# Altium schematic sheet WS2812.SchDoc
size A4
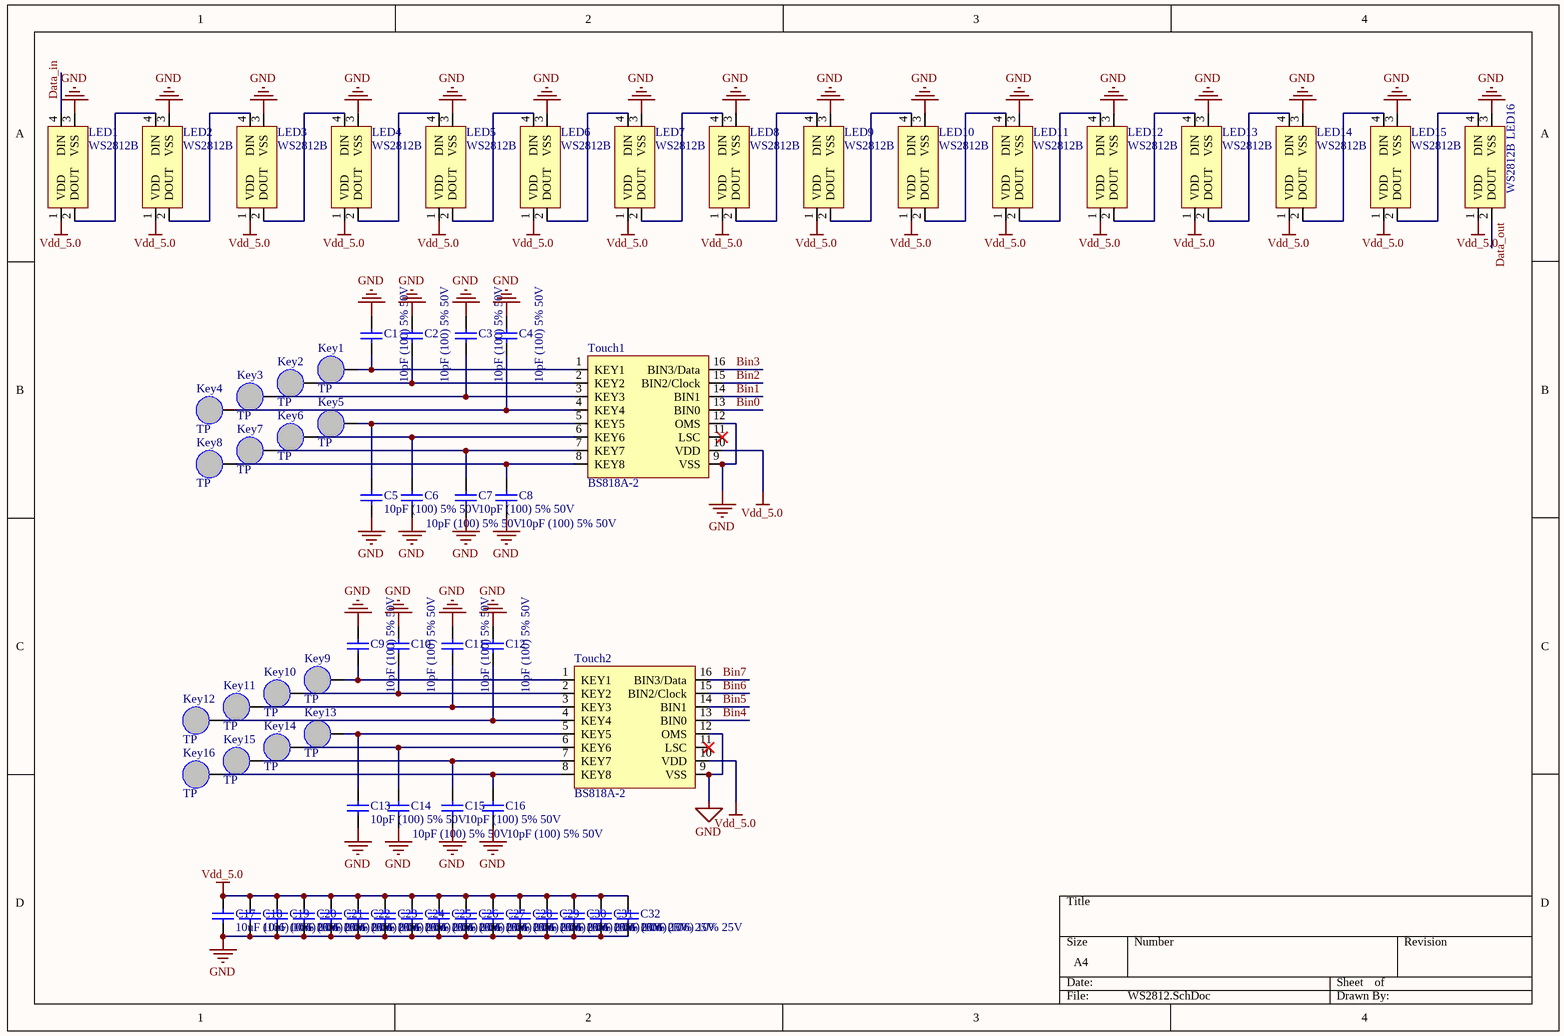
[diagram p0: WS2812.SchDoc]

## Parts
C1  10pF (100) 5% 50V  [0603_C]
C2  10pF (100) 5% 50V  [0603_C]
C3  10pF (100) 5% 50V  [0603_C]
C4  10pF (100) 5% 50V  [0603_C]
C5  10pF (100) 5% 50V  [0603_C]
C6  10pF (100) 5% 50V  [0603_C]
C7  10pF (100) 5% 50V  [0603_C]
C8  10pF (100) 5% 50V  [0603_C]
C9  10pF (100) 5% 50V  [0603_C]
C10  10pF (100) 5% 50V  [0603_C]
C11  10pF (100) 5% 50V  [0603_C]
C12  10pF (100) 5% 50V  [0603_C]
C13  10pF (100) 5% 50V  [0603_C]
C14  10pF (100) 5% 50V  [0603_C]
C15  10pF (100) 5% 50V  [0603_C]
C16  10pF (100) 5% 50V  [0603_C]
C17  10uF (106) 10% 25V  [0805_C]
C18  10uF (106) 10% 25V  [0805_C]
C19  10uF (106) 10% 25V  [0805_C]
C20  10uF (106) 10% 25V  [0805_C]
C21  10uF (106) 10% 25V  [0805_C]
C22  10uF (106) 10% 25V  [0805_C]
C23  10uF (106) 10% 25V  [0805_C]
C24  10uF (106) 10% 25V  [0805_C]
C25  10uF (106) 10% 25V  [0805_C]
C26  10uF (106) 10% 25V  [0805_C]
C27  10uF (106) 10% 25V  [0805_C]
C28  10uF (106) 10% 25V  [0805_C]
C29  10uF (106) 10% 25V  [0805_C]
C30  10uF (106) 10% 25V  [0805_C]
C31  10uF (106) 10% 25V  [0805_C]
C32  10uF (106) 10% 25V  [0805_C]
Key1  TP  [Spring_touch]
Key2  TP  [Spring_touch]
Key3  TP  [Spring_touch]
Key4  TP  [Spring_touch]
Key5  TP  [Spring_touch]
Key6  TP  [Spring_touch]
Key7  TP  [Spring_touch]
Key8  TP  [Spring_touch]
Key9  TP  [Spring_touch]
Key10  TP  [Spring_touch]
Key11  TP  [Spring_touch]
Key12  TP  [Spring_touch]
Key13  TP  [Spring_touch]
Key14  TP  [Spring_touch]
Key15  TP  [Spring_touch]
Key16  TP  [Spring_touch]
LED1  WS2812B  [WS2812]
LED2  WS2812B  [WS2812]
LED3  WS2812B  [WS2812]
LED4  WS2812B  [WS2812]
LED5  WS2812B  [WS2812]
LED6  WS2812B  [WS2812]
LED7  WS2812B  [WS2812]
LED8  WS2812B  [WS2812]
LED9  WS2812B  [WS2812]
LED10  WS2812B  [WS2812]
LED11  WS2812B  [WS2812]
LED12  WS2812B  [WS2812]
LED13  WS2812B  [WS2812]
LED14  WS2812B  [WS2812]
LED15  WS2812B  [WS2812]
LED16  WS2812B  [WS2812]
Touch1  BS818A-2  [SO-16_N]
Touch2  BS818A-2  [SO-16_N]

## Nets
GND: C1.2 C2.2 C3.2 C4.2 C5.2 C6.2 C7.2 C8.2 C9.2 C10.2 C11.2 C12.2 C13.2 C14.2 C15.2 C16.2 C17.1 C18.1 C19.1 C20.1 C21.1 C22.1 C23.1 C24.1 C25.1 C26.1 C27.1 C28.1 C29.1 C30.1 C31.1 C32.1 LED1.3(VSS) LED2.3(VSS) LED3.3(VSS) LED4.3(VSS) LED5.3(VSS) LED6.3(VSS) LED7.3(VSS) LED8.3(VSS) LED9.3(VSS) LED10.3(VSS) LED11.3(VSS) LED12.3(VSS) LED13.3(VSS) LED14.3(VSS) LED15.3(VSS) LED16.3(VSS) Touch1.9(VSS) Touch1.12(OMS) Touch2.9(VSS) Touch2.12(OMS)
Vdd_5.0: C17.2 C18.2 C19.2 C20.2 C21.2 C22.2 C23.2 C24.2 C25.2 C26.2 C27.2 C28.2 C29.2 C30.2 C31.2 C32.2 LED1.1(VDD) LED2.1(VDD) LED3.1(VDD) LED4.1(VDD) LED5.1(VDD) LED6.1(VDD) LED7.1(VDD) LED8.1(VDD) LED9.1(VDD) LED10.1(VDD) LED11.1(VDD) LED12.1(VDD) LED13.1(VDD) LED14.1(VDD) LED15.1(VDD) LED16.1(VDD) Touch1.10(VDD) Touch2.10(VDD)
Bin0: Touch1.13(BIN0)
Bin1: Touch1.14(BIN1)
Bin2: Touch1.15(BIN2/Clock)
Bin3: Touch1.16(BIN3/Data)
Bin4: Touch2.13(BIN0)
Bin5: Touch2.14(BIN1)
Bin6: Touch2.15(BIN2/Clock)
Bin7: Touch2.16(BIN3/Data)
Data_in: LED1.4(DIN)
Data_out: LED16.2(DOUT)
NetC1_1: C1.1 Key1.1 Touch1.1(KEY1)
NetC2_1: C2.1 Key2.1 Touch1.2(KEY2)
NetC3_1: C3.1 Key3.1 Touch1.3(KEY3)
NetC4_1: C4.1 Key4.1 Touch1.4(KEY4)
NetC5_1: C5.1 Key5.1 Touch1.5(KEY5)
NetC6_1: C6.1 Key6.1 Touch1.6(KEY6)
NetC7_1: C7.1 Key7.1 Touch1.7(KEY7)
NetC8_1: C8.1 Key8.1 Touch1.8(KEY8)
NetC9_1: C9.1 Key9.1 Touch2.1(KEY1)
NetC10_1: C10.1 Key10.1 Touch2.2(KEY2)
NetC11_1: C11.1 Key11.1 Touch2.3(KEY3)
NetC12_1: C12.1 Key12.1 Touch2.4(KEY4)
NetC13_1: C13.1 Key13.1 Touch2.5(KEY5)
NetC14_1: C14.1 Key14.1 Touch2.6(KEY6)
NetC15_1: C15.1 Key15.1 Touch2.7(KEY7)
NetC16_1: C16.1 Key16.1 Touch2.8(KEY8)
NetLED1_2: LED1.2(DOUT) LED2.4(DIN)
NetLED2_2: LED2.2(DOUT) LED3.4(DIN)
NetLED3_2: LED3.2(DOUT) LED4.4(DIN)
NetLED4_2: LED4.2(DOUT) LED5.4(DIN)
NetLED5_2: LED5.2(DOUT) LED6.4(DIN)
NetLED6_2: LED6.2(DOUT) LED7.4(DIN)
NetLED7_2: LED7.2(DOUT) LED8.4(DIN)
NetLED8_2: LED8.2(DOUT) LED9.4(DIN)
NetLED9_2: LED9.2(DOUT) LED10.4(DIN)
NetLED10_2: LED10.2(DOUT) LED11.4(DIN)
NetLED11_2: LED11.2(DOUT) LED12.4(DIN)
NetLED12_2: LED12.2(DOUT) LED13.4(DIN)
NetLED13_2: LED13.2(DOUT) LED14.4(DIN)
NetLED14_2: LED14.2(DOUT) LED15.4(DIN)
NetLED15_2: LED15.2(DOUT) LED16.4(DIN)

Not connected (* = marked no-connect by the designer): Touch1 11(LSC)*; Touch2 11(LSC)*

## Library data of the parts
C1-C16 = 0603 10pF (100) 5% 50V: 贴片电容; ComponentLink1Description: 供应商链接; ComponentLink1URL: http://www.szlcsc.com/product/details_1986.html; Package: 0603; Supplier: LC; SuppliersPartNumber: C1634
C17-C32 = 0805 10uF (106) 10% 25V: 贴片电容; ComponentLink1Description: 供应商链接; ComponentLink1URL: http://www.szlcsc.com/product/details_16532.html; Package: 0805; Supplier: LC; SuppliersPartNumber: C15850